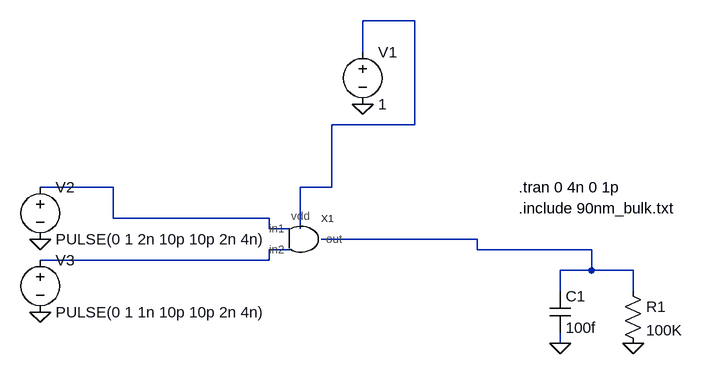
[diagram p0: schematic and-test.asc]
and-test.asc, the LTspice schematic file:
Version 4
SHEET 1 880 680
WIRE 384 -192 304 -192
WIRE 304 -144 304 -192
WIRE 384 -32 384 -192
WIRE 384 -32 256 -32
WIRE -80 64 -192 64
WIRE 256 64 256 -32
WIRE 256 64 208 64
WIRE -80 112 -80 64
WIRE 160 112 -80 112
WIRE 160 128 160 112
WIRE 192 128 160 128
WIRE 208 128 208 64
WIRE 480 144 240 144
WIRE 192 160 160 160
WIRE 480 160 480 144
WIRE 656 160 480 160
WIRE 160 176 160 160
WIRE 160 176 -192 176
WIRE 656 192 656 160
WIRE 656 192 608 192
WIRE 720 192 656 192
WIRE 608 224 608 192
WIRE 720 224 720 192
WIRE 608 304 608 288
FLAG 304 -64 0
FLAG 608 304 0
FLAG 720 304 0
FLAG -192 144 0
FLAG -192 256 0
SYMBOL voltage 304 -160 R0
WINDOW 123 0 0 Left 2
WINDOW 39 0 0 Left 2
SYMATTR InstName V1
SYMATTR Value 1
SYMBOL voltage -192 48 R0
WINDOW 123 0 0 Left 2
WINDOW 39 0 0 Left 2
SYMATTR InstName V2
SYMATTR Value PULSE(0 1 2n 10p 10p 2n 4n)
SYMBOL res 704 208 R0
SYMATTR InstName R1
SYMATTR Value 100K
SYMBOL cap 592 224 R0
SYMATTR InstName C1
SYMATTR Value 100f
SYMBOL voltage -192 160 R0
WINDOW 123 0 0 Left 2
WINDOW 39 0 0 Left 2
SYMATTR InstName V3
SYMATTR Value PULSE(0 1 1n 10p 10p 2n 4n)
SYMBOL and 208 144 R0
SYMATTR InstName X1
TEXT 544 64 Left 2 !.tran 0 4n 0 1p
TEXT 544 96 Left 2 !.include 90nm_bulk.txt

The netlist it stands for:
* and-test.asc
V1 N001 0 1
V2 N002 0 PULSE(0 1 2n 10p 10p 2n 4n)
R1 N003 0 100K
C1 N003 0 100f
V3 N004 0 PULSE(0 1 1n 10p 10p 2n 4n)
XX1 N002 N004 N001 N003 and  ; pins in1 in2 vdd out
.tran 0 4n 0 1p
.include 90nm_bulk.txt
.backanno
.end